# Altium schematic sheet ESCHeaders.SchDoc
size A
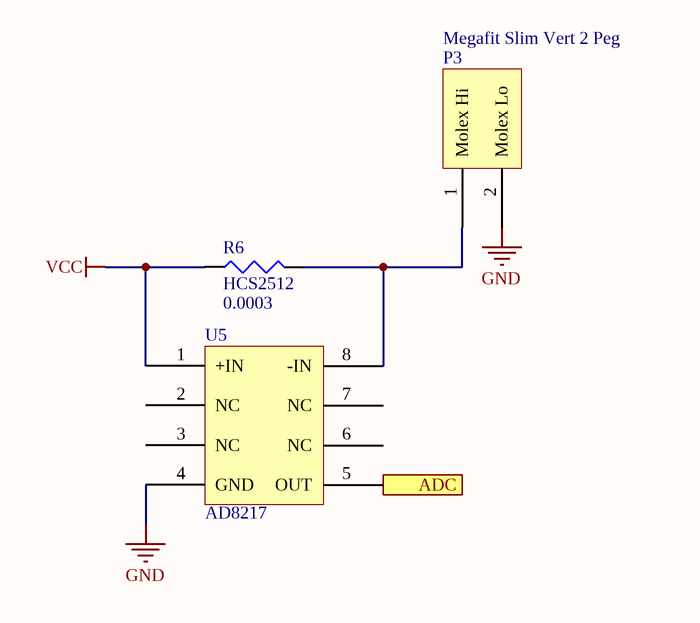
[diagram p0: ESCHeaders.SchDoc]

## Parts
P3  Megafit Slim Vert 2 Peg  [76829-0102]
R6  HCS2512  value 0.0003  [HCS2512FTL300CT-ND_DT]
U5  AD8217  [AD8217_DT]

## Ports
ADC (out)

## Nets
GND: P3.2(Molex_Lo) U5.4(GND)
VCC: R6.1 U5.1(+IN)
ADC: U5.5(OUT) ; port ADC
NetP3_1: P3.1(Molex_Hi) R6.2 U5.8(-IN)

Not connected (* = marked no-connect by the designer): U5 2(NC) 3(NC) 6(NC) 7(NC)

## Library data of the parts
R6 = Res3: Resistor; mfgr_part_num: HCS2512FTL300; Published: 8-Jun-2000; LatestRevisionDate: 29-May-2009; LatestRevisionNote: IPC-7351 Footprint Added.; PackageReference: J1-0603; Publisher: Altium Limited; PackageDescription: Chip Resistor
U5 = AD8217: mfgr_part_num: AD8217BRMZ-R7
P3 = Megafit Slim Vert 2 Peg: mfgr_part_num: 76829-0102